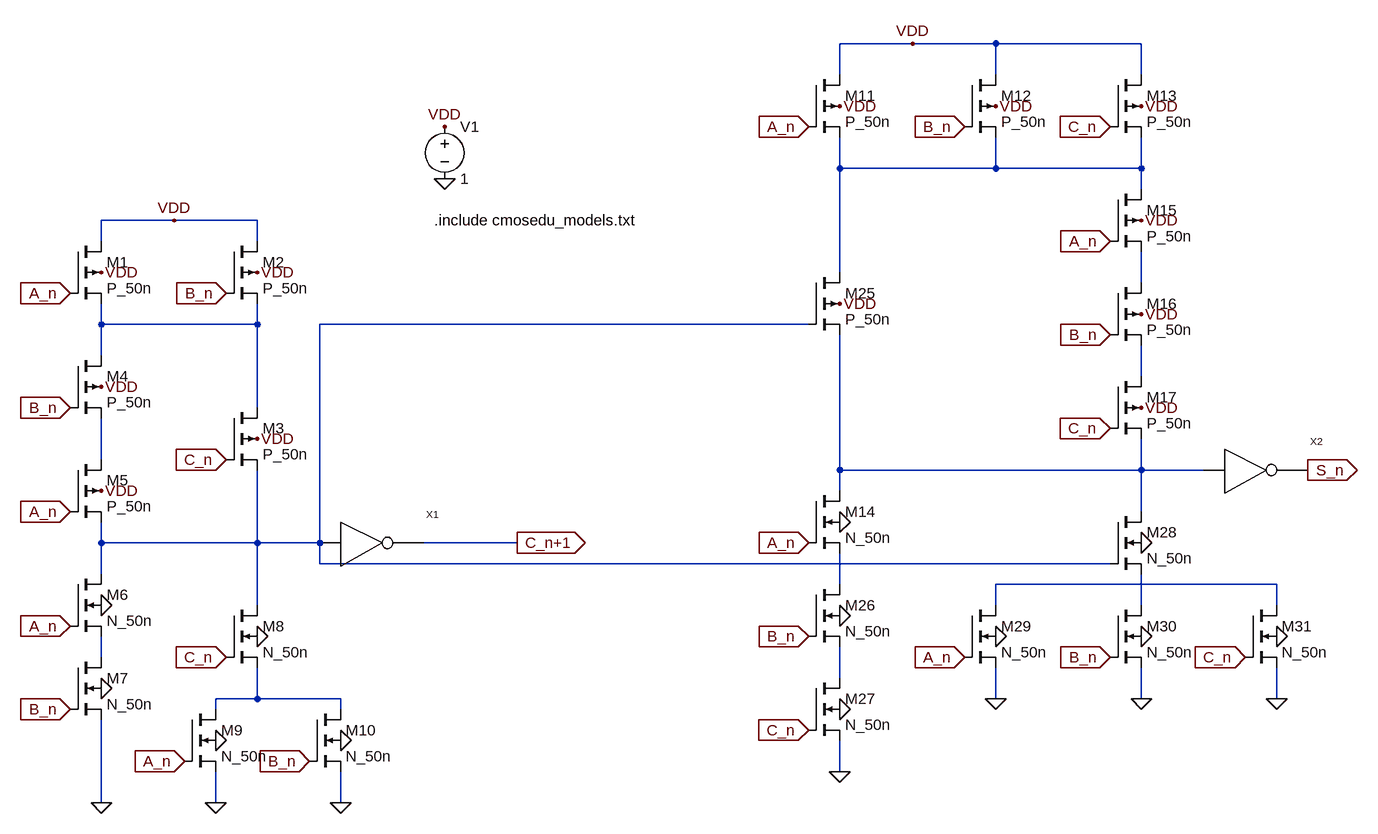
[diagram p0: schematic FullAdder.asc]
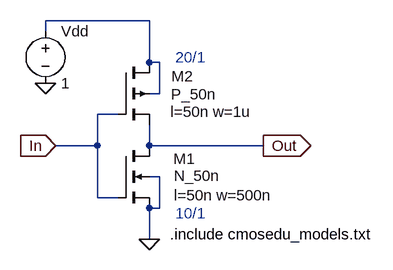
[diagram p1: sub-circuit inverter.asc]
FullAdder.asc, the LTspice schematic file:
Version 4
SHEET 1 2088 932
WIRE 768 -800 656 -800
WIRE 896 -800 768 -800
WIRE 1120 -800 896 -800
WIRE 656 -752 656 -800
WIRE 896 -752 896 -800
WIRE 1120 -752 1120 -800
WIRE 656 -608 656 -656
WIRE 896 -608 896 -656
WIRE 896 -608 656 -608
WIRE 1120 -608 1120 -656
WIRE 1120 -608 896 -608
WIRE 1120 -576 1120 -608
WIRE -368 -528 -480 -528
WIRE -240 -528 -368 -528
WIRE -480 -496 -480 -528
WIRE -240 -496 -240 -528
WIRE 656 -448 656 -608
WIRE 1120 -432 1120 -480
WIRE -480 -368 -480 -400
WIRE -240 -368 -240 -400
WIRE -240 -368 -480 -368
WIRE 608 -368 -144 -368
WIRE -480 -320 -480 -368
WIRE 1120 -288 1120 -336
WIRE -240 -240 -240 -368
WIRE -480 -160 -480 -224
WIRE 656 -144 656 -352
WIRE 1120 -144 1120 -192
WIRE 1120 -144 656 -144
WIRE 1216 -144 1120 -144
WIRE 656 -112 656 -144
WIRE 1120 -80 1120 -144
WIRE -480 -32 -480 -64
WIRE -240 -32 -240 -144
WIRE -240 -32 -480 -32
WIRE -144 -32 -144 -368
WIRE -144 -32 -240 -32
WIRE 160 -32 16 -32
WIRE -144 0 -144 -32
WIRE 1072 0 -144 0
WIRE -480 16 -480 -32
WIRE 656 32 656 -16
WIRE 1328 32 896 32
WIRE -240 64 -240 -32
WIRE 896 64 896 32
WIRE 1120 64 1120 16
WIRE 1328 64 1328 32
WIRE -480 144 -480 112
WIRE 656 176 656 128
WIRE -240 208 -240 160
WIRE -240 208 -304 208
WIRE -112 208 -240 208
WIRE 896 208 896 160
WIRE 1120 208 1120 160
WIRE 1328 208 1328 160
WIRE -304 224 -304 208
WIRE -112 224 -112 208
WIRE 656 320 656 272
WIRE -480 368 -480 240
WIRE -304 368 -304 320
WIRE -112 368 -112 320
FLAG -480 368 0
FLAG -304 368 0
FLAG -112 368 0
FLAG -480 192 0
FLAG -480 64 0
FLAG -240 112 0
FLAG -304 272 0
FLAG -112 272 0
FLAG 48 -592 0
FLAG 48 -672 VDD
FLAG -480 -112 VDD
FLAG -480 -272 VDD
FLAG -240 -192 VDD
FLAG -240 -448 VDD
FLAG -480 -448 VDD
FLAG 1120 -704 VDD
FLAG 896 -704 VDD
FLAG 656 -704 VDD
FLAG 1120 -528 VDD
FLAG 1120 -384 VDD
FLAG 1120 -240 VDD
FLAG -528 -416 A_n
IOPIN -528 -416 In
FLAG -528 -240 B_n
IOPIN -528 -240 In
FLAG 160 -32 C_n+1
IOPIN 160 -32 Out
FLAG -528 96 A_n
IOPIN -528 96 In
FLAG -352 304 A_n
IOPIN -352 304 In
FLAG 1072 -496 A_n
IOPIN 1072 -496 In
FLAG 608 -672 A_n
IOPIN 608 -672 In
FLAG -528 224 B_n
IOPIN -528 224 In
FLAG -160 304 B_n
IOPIN -160 304 In
FLAG -288 -416 B_n
IOPIN -288 -416 In
FLAG 1072 -352 B_n
IOPIN 1072 -352 In
FLAG 848 -672 B_n
IOPIN 848 -672 In
FLAG 1376 -144 S_n
IOPIN 1376 -144 Out
FLAG -528 -80 A_n
IOPIN -528 -80 In
FLAG -288 -160 C_n
IOPIN -288 -160 In
FLAG -288 144 C_n
IOPIN -288 144 In
FLAG 1072 -208 C_n
IOPIN 1072 -208 In
FLAG 1072 -672 C_n
IOPIN 1072 -672 In
FLAG 656 -400 VDD
FLAG 656 320 0
FLAG 656 80 0
FLAG 656 -64 0
FLAG 656 224 0
FLAG 608 -32 A_n
IOPIN 608 -32 In
FLAG 608 112 B_n
IOPIN 608 112 In
FLAG 608 256 C_n
IOPIN 608 256 In
FLAG 896 112 0
FLAG 896 208 0
FLAG 1120 208 0
FLAG 1120 112 0
FLAG 1120 -32 0
FLAG 1328 112 0
FLAG 1328 208 0
FLAG 848 144 A_n
IOPIN 848 144 In
FLAG 1072 144 B_n
IOPIN 1072 144 In
FLAG 1280 144 C_n
IOPIN 1280 144 In
FLAG -368 -528 VDD
FLAG 768 -800 VDD
SYMBOL pmos4 -528 -496 R0
SYMATTR InstName M1
SYMATTR Value P_50n
SYMATTR Value2 l=50n w=3u
SYMBOL pmos4 -288 -496 R0
SYMATTR InstName M2
SYMATTR Value P_50n
SYMATTR Value2 l=50n w=3u
SYMBOL pmos4 -288 -240 R0
SYMATTR InstName M3
SYMATTR Value P_50n
SYMATTR Value2 l=50n w=1.5u
SYMBOL pmos4 -528 -320 R0
SYMATTR InstName M4
SYMATTR Value P_50n
SYMATTR Value2 l=50n w=3u
SYMBOL pmos4 -528 -160 R0
SYMATTR InstName M5
SYMATTR Value P_50n
SYMATTR Value2 l=50n w=3u
SYMBOL nmos4 -528 16 R0
SYMATTR InstName M6
SYMATTR Value N_50n
SYMATTR Value2 l=50n w=1u
SYMBOL nmos4 -528 144 R0
SYMATTR InstName M7
SYMATTR Value N_50n
SYMATTR Value2 l=50n w=1u
SYMBOL nmos4 -288 64 R0
SYMATTR InstName M8
SYMATTR Value N_50n
SYMATTR Value2 l=50n w=1u
SYMBOL nmos4 -352 224 R0
SYMATTR InstName M9
SYMATTR Value N_50n
SYMATTR Value2 l=50n w=1u
SYMBOL nmos4 -160 224 R0
SYMATTR InstName M10
SYMATTR Value N_50n
SYMATTR Value2 l=50n w=1u
SYMBOL Inverter -112 -96 R0
SYMATTR InstName X1
SYMBOL pmos4 608 -752 R0
SYMATTR InstName M11
SYMATTR Value P_50n
SYMATTR Value2 l=50n w=4u
SYMBOL pmos4 848 -752 R0
SYMATTR InstName M12
SYMATTR Value P_50n
SYMATTR Value2 l=50n w=4u
SYMBOL pmos4 1072 -752 R0
SYMATTR InstName M13
SYMATTR Value P_50n
SYMATTR Value2 l=50n w=4u
SYMBOL pmos4 1072 -576 R0
SYMATTR InstName M15
SYMATTR Value P_50n
SYMATTR Value2 l=50n w=4u
SYMBOL pmos4 1072 -432 R0
SYMATTR InstName M16
SYMATTR Value P_50n
SYMATTR Value2 l=50n w=4u
SYMBOL pmos4 1072 -288 R0
SYMATTR InstName M17
SYMATTR Value P_50n
SYMATTR Value2 l=50n w=4u
SYMBOL Inverter 1248 -208 R0
SYMATTR InstName X2
SYMBOL pmos4 608 -448 R0
SYMATTR InstName M25
SYMATTR Value P_50n
SYMATTR Value2 l=50n w=1333n
SYMBOL nmos4 608 -112 R0
SYMATTR InstName M14
SYMATTR Value N_50n
SYMATTR Value2 l=50n w=1.5u
SYMBOL nmos4 608 32 R0
SYMATTR InstName M26
SYMATTR Value N_50n
SYMATTR Value2 l=50n w=1.5u
SYMBOL nmos4 608 176 R0
SYMATTR InstName M27
SYMATTR Value N_50n
SYMATTR Value2 l=50n w=1.5u
SYMBOL nmos4 1072 -80 R0
SYMATTR InstName M28
SYMATTR Value N_50n
SYMATTR Value2 l=50n w=1u
SYMBOL nmos4 848 64 R0
SYMATTR InstName M29
SYMATTR Value N_50n
SYMATTR Value2 l=50n w=1u
SYMBOL nmos4 1072 64 R0
SYMATTR InstName M30
SYMATTR Value N_50n
SYMATTR Value2 l=50n w=1u
SYMBOL nmos4 1280 64 R0
SYMATTR InstName M31
SYMATTR Value N_50n
SYMATTR Value2 l=50n w=1u
SYMBOL voltage 48 -688 R0
WINDOW 123 0 0 Left 0
WINDOW 39 0 0 Left 0
SYMATTR InstName V1
SYMATTR Value 1
TEXT 32 -528 Left 2 !.include cmosedu_models.txt

inverter.asc, the sub-circuit schematic file:
Version 4
SHEET 1 1136 680
WIRE 448 -368 288 -368
WIRE 288 -352 288 -368
WIRE 448 -304 448 -368
WIRE 464 -304 448 -304
WIRE 464 -256 464 -304
WIRE 464 -256 448 -256
WIRE 400 -224 368 -224
WIRE 368 -176 368 -224
WIRE 368 -176 304 -176
WIRE 448 -176 448 -208
WIRE 624 -176 448 -176
WIRE 464 -128 448 -128
WIRE 368 -96 368 -176
WIRE 400 -96 368 -96
WIRE 464 -80 464 -128
WIRE 464 -80 448 -80
WIRE 448 -32 448 -80
FLAG 304 -176 In
IOPIN 304 -176 In
FLAG 624 -176 Out
IOPIN 624 -176 Out
FLAG 448 -32 0
FLAG 288 -272 0
SYMBOL nmos4 400 -176 R0
WINDOW 0 119 20 Right 2
WINDOW 3 157 46 Right 2
WINDOW 123 238 76 Right 2
SYMATTR InstName M1
SYMATTR Value N_50n
SYMATTR Value2 l=50n w=500n
SYMBOL pmos4 400 -304 R0
WINDOW 0 116 21 Right 2
WINDOW 3 151 49 Right 2
WINDOW 123 206 76 Right 2
SYMATTR InstName M2
SYMATTR Value P_50n
SYMATTR Value2 l=50n w=1u
SYMBOL voltage 288 -368 R0
SYMATTR InstName Vdd
SYMATTR Value 1
TEXT 488 -312 Left 2 ;20/1
TEXT 488 -72 Left 2 ;10/1
TEXT 480 -40 Left 2 !.include cmosedu_models.txt

The netlist it stands for:
* FullAdder.asc
M1 VDD A_n N003 VDD P_50n l=50n w=3u
M2 VDD B_n N003 VDD P_50n l=50n w=3u
M3 N003 C_n N004 VDD P_50n l=50n w=1.5u
M4 N003 B_n N006 VDD P_50n l=50n w=3u
M5 N006 A_n N004 VDD P_50n l=50n w=3u
M6 N004 A_n N011 0 N_50n l=50n w=1u
M7 N011 B_n 0 0 N_50n l=50n w=1u
M8 N004 C_n N013 0 N_50n l=50n w=1u
M9 N013 A_n 0 0 N_50n l=50n w=1u
M10 N013 B_n 0 0 N_50n l=50n w=1u
XX1 N004 C_n+1 inverter
M11 VDD A_n N001 VDD P_50n l=50n w=4u
M12 VDD B_n N001 VDD P_50n l=50n w=4u
M13 VDD C_n N001 VDD P_50n l=50n w=4u
M15 N001 A_n N002 VDD P_50n l=50n w=4u
M16 N002 B_n N005 VDD P_50n l=50n w=4u
M17 N005 C_n N007 VDD P_50n l=50n w=4u
XX2 N007 S_n inverter
M25 N001 N004 N007 VDD P_50n l=50n w=1333n
M14 N007 A_n N008 0 N_50n l=50n w=1.5u
M26 N008 B_n N012 0 N_50n l=50n w=1.5u
M27 N012 C_n 0 0 N_50n l=50n w=1.5u
M28 N007 N004 N010 0 N_50n l=50n w=1u
M29 N009 A_n 0 0 N_50n l=50n w=1u
M30 N010 B_n 0 0 N_50n l=50n w=1u
M31 N009 C_n 0 0 N_50n l=50n w=1u
V1 VDD 0 1

* block symbol definitions
.subckt inverter In Out
M1 Out In 0 0 N_50n l=50n w=500n
M2 N001 In Out N001 P_50n l=50n w=1u
Vdd N001 0 1
* 20/1
* 10/1
.include cmosedu_models.txt
.ends inverter

.model NMOS NMOS
.model PMOS PMOS
.lib standard.mos
.include cmosedu_models.txt
.backanno
.end